# Altium project FMC_PINHEADER_BOARD.PrjPcb
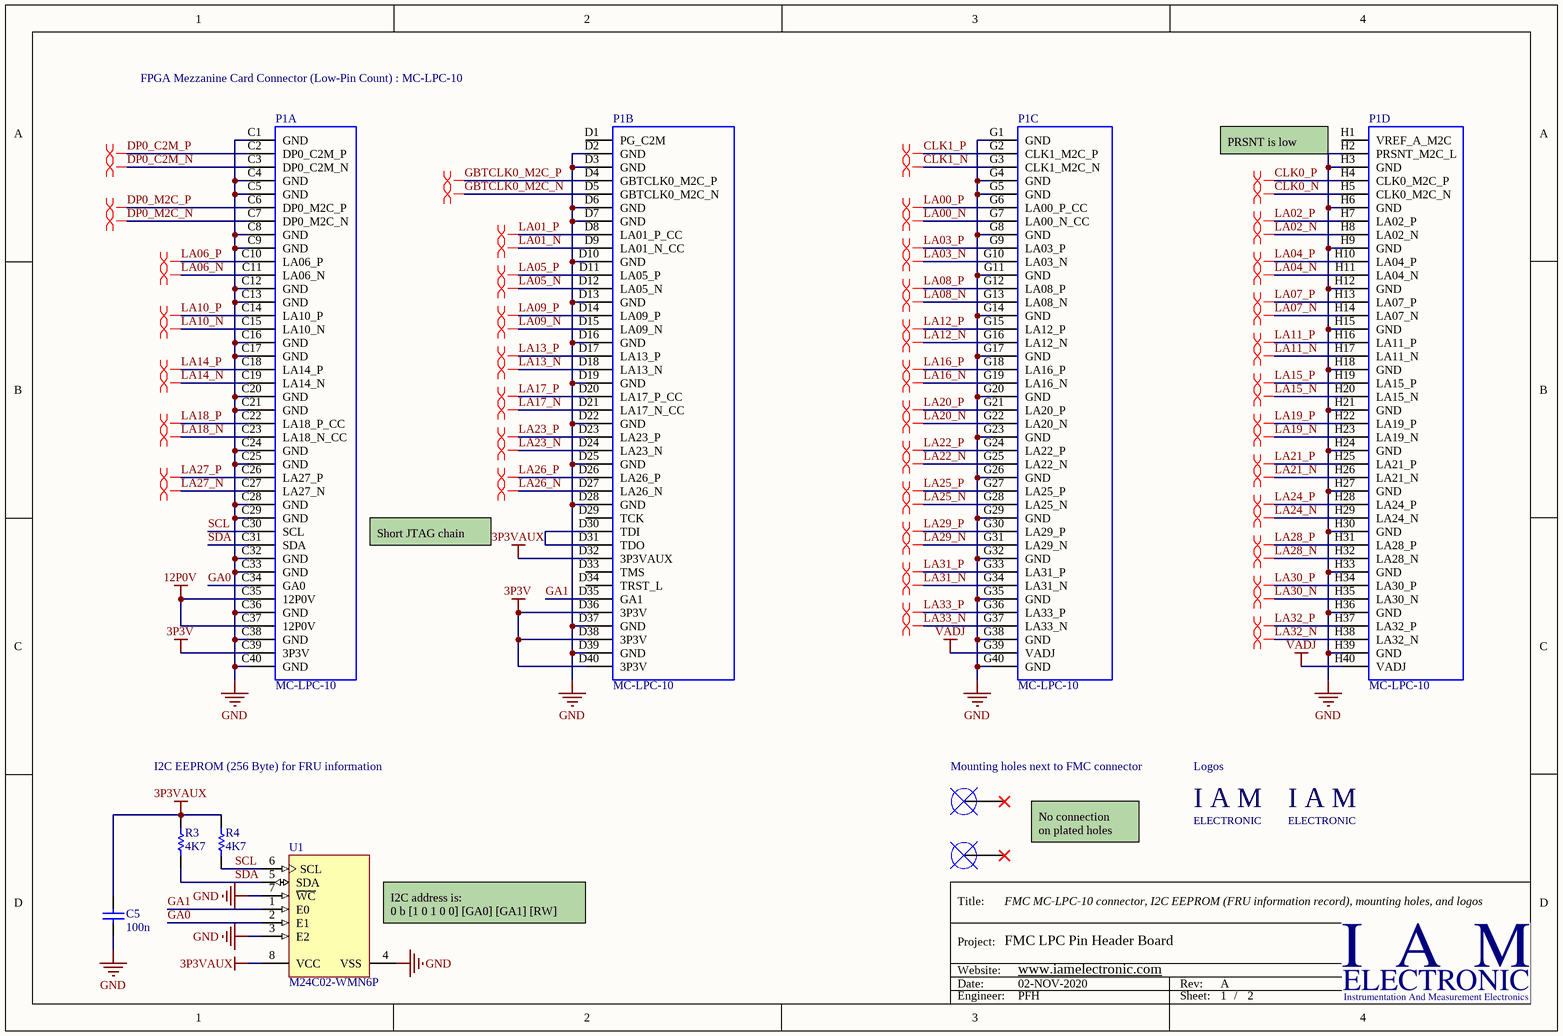
[diagram p0: FMC_LPC.SchDoc]
2 sheets, 25 parts. Net scope: global (net labels, ports and power ports of the same name join across sheets).
Board file: FMC_PINHEADER_BOARD.PcbDoc
Sheets:
  FMC_LPC.SchDoc
  FMC_PINBREAKOUT.SchDoc

## Sheet FMC_LPC.SchDoc: FMC MC-LPC-10 connector, I2C EEPROM (FRU information record), mounting holes, and logos
size A4; Date: 02-NOV-2020; DrawnBy: PFH; Engineer: PFH; Organization: IAM Electronic GmbH; Revision: A; SheetNumber: 1; SheetTotal: 2; Projekt: FMC LPC Pin Header Board; Website: www.iamelectronic.com; ImagePath: FMC LPC Pinheader Board

### Parts
C5  100n  [CAPC1005X55X25ML05T10]
MHN  2.7mm  [Mounting_Hole_Plated_2.7mm-COVERED]  (value not drawn)  (no BOM)
MHS  2.7mm  [Mounting_Hole_Plated_2.7mm-COVERED]  (value not drawn)  (no BOM)
P1  MC-LPC-10  [ASP-134604-01]  (parts A,B,C,D of 4)
R3  4K7  [RESC1005X40X25ML05T05]
R4  4K7  [RESC1005X40X25ML05T05]
STR1  IAM LOGO  [IAM LOGO - SMALL - WWW]  (value not drawn)  (no BOM)
STR2  IAM LOGO  [IAM LOGO - MEDIUM - WWW]  (value not drawn)  (no BOM)
U1  M24C02-WMN6P  [STM-SO-8_D_L]

### Nets
3P3V: P1.C39(3P3V) P1.D36(3P3V) P1.D38(3P3V) P1.D40(3P3V)
3P3VAUX: C5.2 P1.D32(3P3VAUX) R3.2 R4.2 U1.8(VCC)
12P0V: P1.C35(12P0V) P1.C37(12P0V)
GND: C5.1 P1.C1(GND) P1.C4(GND) P1.C5(GND) P1.C8(GND) P1.C9(GND) P1.C12(GND) P1.C13(GND) P1.C16(GND) P1.C17(GND) P1.C20(GND) P1.C21(GND) P1.C24(GND) P1.C25(GND) P1.C28(GND) P1.C29(GND) P1.C32(GND) P1.C33(GND) P1.C36(GND) P1.C38(GND) P1.C40(GND) P1.D2(GND) P1.D3(GND) P1.D6(GND) P1.D7(GND) P1.D10(GND) P1.D13(GND) P1.D16(GND) P1.D19(GND) P1.D22(GND) P1.D25(GND) P1.D28(GND) P1.D37(GND) P1.D39(GND) P1.G1(GND) P1.G4(GND) P1.G5(GND) P1.G8(GND) P1.G11(GND) P1.G14(GND) P1.G17(GND) P1.G20(GND) P1.G23(GND) P1.G26(GND) P1.G29(GND) P1.G32(GND) P1.G35(GND) P1.G38(GND) P1.G40(GND) P1.H2(PRSNT_M2C_L) P1.H3(GND) P1.H6(GND) P1.H9(GND) P1.H12(GND) P1.H15(GND) P1.H18(GND) P1.H21(GND) P1.H24(GND) P1.H27(GND) P1.H30(GND) P1.H33(GND) P1.H36(GND) P1.H39(GND) U1.3(E2) U1.4(VSS) U1.7(~{WC})
VADJ: P1.G39(VADJ) P1.H40(VADJ)
CLK0_N: P1.H5(CLK0_M2C_N)
CLK0_P: P1.H4(CLK0_M2C_P)
CLK1_N: P1.G3(CLK1_M2C_N)
CLK1_P: P1.G2(CLK1_M2C_P)
DP0_C2M_N: P1.C3(DP0_C2M_N)
DP0_C2M_P: P1.C2(DP0_C2M_P)
DP0_M2C_N: P1.C7(DP0_M2C_N)
DP0_M2C_P: P1.C6(DP0_M2C_P)
GA0: P1.C34(GA0) U1.2(E1)
GA1: P1.D35(GA1) U1.1(E0)
GBTCLK0_M2C_N: P1.D5(GBTCLK0_M2C_N)
GBTCLK0_M2C_P: P1.D4(GBTCLK0_M2C_P)
LA00_N: P1.G7(LA00_N_CC)
LA00_P: P1.G6(LA00_P_CC)
LA01_N: P1.D9(LA01_N_CC)
LA01_P: P1.D8(LA01_P_CC)
LA02_N: P1.H8(LA02_N)
LA02_P: P1.H7(LA02_P)
LA03_N: P1.G10(LA03_N)
LA03_P: P1.G9(LA03_P)
LA04_N: P1.H11(LA04_N)
LA04_P: P1.H10(LA04_P)
LA05_N: P1.D12(LA05_N)
LA05_P: P1.D11(LA05_P)
LA06_N: P1.C11(LA06_N)
LA06_P: P1.C10(LA06_P)
LA07_N: P1.H14(LA07_N)
LA07_P: P1.H13(LA07_P)
LA08_N: P1.G13(LA08_N)
LA08_P: P1.G12(LA08_P)
LA09_N: P1.D15(LA09_N)
LA09_P: P1.D14(LA09_P)
LA10_N: P1.C15(LA10_N)
LA10_P: P1.C14(LA10_P)
LA11_N: P1.H17(LA11_N)
LA11_P: P1.H16(LA11_P)
LA12_N: P1.G16(LA12_N)
LA12_P: P1.G15(LA12_P)
LA13_N: P1.D18(LA13_N)
LA13_P: P1.D17(LA13_P)
LA14_N: P1.C19(LA14_N)
LA14_P: P1.C18(LA14_P)
LA15_N: P1.H20(LA15_N)
LA15_P: P1.H19(LA15_P)
LA16_N: P1.G19(LA16_N)
LA16_P: P1.G18(LA16_P)
LA17_N: P1.D21(LA17_N_CC)
LA17_P: P1.D20(LA17_P_CC)
LA18_N: P1.C23(LA18_N_CC)
LA18_P: P1.C22(LA18_P_CC)
LA19_N: P1.H23(LA19_N)
LA19_P: P1.H22(LA19_P)
LA20_N: P1.G22(LA20_N)
LA20_P: P1.G21(LA20_P)
LA21_N: P1.H26(LA21_N)
LA21_P: P1.H25(LA21_P)
LA22_N: P1.G25(LA22_N)
LA22_P: P1.G24(LA22_P)
LA23_N: P1.D24(LA23_N)
LA23_P: P1.D23(LA23_P)
LA24_N: P1.H29(LA24_N)
LA24_P: P1.H28(LA24_P)
LA25_N: P1.G28(LA25_N)
LA25_P: P1.G27(LA25_P)
LA26_N: P1.D27(LA26_N)
LA26_P: P1.D26(LA26_P)
LA27_N: P1.C27(LA27_N)
LA27_P: P1.C26(LA27_P)
LA28_N: P1.H32(LA28_N)
LA28_P: P1.H31(LA28_P)
LA29_N: P1.G31(LA29_N)
LA29_P: P1.G30(LA29_P)
LA30_N: P1.H35(LA30_N)
LA30_P: P1.H34(LA30_P)
LA31_N: P1.G34(LA31_N)
LA31_P: P1.G33(LA31_P)
LA32_N: P1.H38(LA32_N)
LA32_P: P1.H37(LA32_P)
LA33_N: P1.G37(LA33_N)
LA33_P: P1.G36(LA33_P)
SCL: P1.C30(SCL) R4.1 U1.6(SCL)
SDA: P1.C31(SDA) R3.1 U1.5(SDA)
NetP1_D30: P1.D30(TDI) P1.D31(TDO)

Not connected (* = marked no-connect by the designer): MHN 0*; MHS 0*; P1 D1(PG_C2M) D29(TCK) D33(TMS) D34(TRST_L) H1(VREF_A_M2C)

### Layout directives
differential pair: CLK0_N, CLK0_P, CLK1_N, CLK1_P, DP0_C2M_N, DP0_C2M_P, DP0_M2C_N, DP0_M2C_P, GBTCLK0_M2C_N, GBTCLK0_M2C_P, LA00_N, LA00_P, LA01_N, LA01_P, LA02_N, LA02_P, LA03_N, LA03_P, LA04_N, LA04_P, LA05_N, LA05_P, LA06_N, LA06_P, LA07_N, LA07_P, LA08_N, LA08_P, LA09_N, LA09_P, LA10_N, LA10_P, LA11_N, LA11_P, LA12_N, LA12_P, LA13_N, LA13_P, LA14_N, LA14_P, LA15_N, LA15_P, LA16_N, LA16_P, LA17_N, LA17_P, LA18_N, LA18_P, LA19_N, LA19_P, LA20_N, LA20_P, LA21_N, LA21_P, LA22_N, LA22_P, LA23_N, LA23_P, LA24_N, LA24_P, LA25_N, LA25_P, LA26_N, LA26_P, LA27_N, LA27_P, LA28_N, LA28_P, LA29_N, LA29_P, LA30_N, LA30_P, LA31_N, LA31_P, LA32_N, LA32_P, LA33_N, LA33_P

### Notes on the sheet
- FPGA Mezzanine Card Connector (Low-Pin Count) : MC-LPC-10
- (near P1) PRSNT is low
- Short JTAG chain
- I2C EEPROM (256 Byte) for FRU information
- Mounting holes next to FMC connector
- (near STR1) Logos
- No connection
  on plated holes
- (near U1) I2C address is:
  0 b [1 0 1 0 0] [GA0] [GA1] [RW]
- Title:
- Project:
- Date:
- Website:
- Rev:
- Engineer:
- Sheet:
- /
- (in symbol IAM_LOGO) I A M; ELECTRONIC

### Library data of the parts
C5 = CMP-2100-03641-1: Chip Capacitor, 0.1 uF, +/- 10%, 16 V, -55 to 125 degC, 0402 (1005 Metric), RoHS, Tape and Reel; Manufacturer: Murata; Part: GRM155R71C104KA88D; Material: Ceramic; Insulation Resistance: 10GR; Voltage: 16V; Dielectric: X7R; Capacitance: 100nF; REACH SVHC: NoSVHC; Depth: 0.5mm; Case/Package: 0402; Datasheet URL: http://psearch.en.murata.com/capacitor/product/GRM155R71C104KA88%23.pdf; Lead Free: LeadFree; Dielectric Material: Ceramic; Manufacturer URL: http://www.murata.com/; Min Operating Temperature: -55degC; Length: 1mm; Case Code (Metric): 1005; Radiation Hardening: No; Package Reference: 0402; RoHSCompliant: true; Datasheet Version: 42675.0; Thickness: 0.022inch; Packaging: TapeandReel; Voltage Rating (DC): 16V; Tolerance: 10%; Max Operating Temperature: 125degC; Package Description: 2-Pin Surface Mount Device, Body 1 x 0.5 mm; Mount: SurfaceMount; Height: 0.5mm; Width: 0.5mm; Number of Pins: 2; Voltage Rating: 16V; Case Code (Imperial): 0402; Termination: SMD/SMT; Package Quantity: 1
MHN MHS = Mounting_Hole_2.7mm: Mounting hole, hole size 2.7mm; Hole radius: 2.7 mm; Diameter (plated): *; Keep out (radius): *; Plated: *
P1 = MC-LPC-10: MC-LPC-10, FMC Low-pin count connector, lead free, 160 I/Os, male, 10 mm mated stack height; Manufacturer: Samtec; Manufacturer Ref: SEAM-40-03.5-S-10-2-A-K-TR-VITA57; Pitch: 1.27 mm; Mated Stack Height: 10 mm; Solder Type: Lead-Free; Number I/O: 160; PartName: ASP-134604-01; Part: ASP-134604-01; Vita PartNumber: MC-LPC-10; Pin Count: Low; Gender: male; Supplier 1: Digi-Key; Supplier Part Number 1: SAM8732-ND
R3 R4 = CMP-2002-00051-2: Chip Resistor, 4.7 KOhm, +/- 1%, 63 mW, -55 to 155 degC, 0402 (1005 Metric), RoHS, Tape and Reel; PartNumber: CRCW04024K70FKED; Manufacturer: Vishay; Power Rating: 63 mW; Voltage Rating: 50 V; Length: 1 mm; Mount: Surface Mount; Case Code (Metric): 1005; ComponentLink1Description: Datasheet; Package Quantity: 10000; Case Code (Imperial): 0402; Max Operating Temperature: 155 degC; Case/Package: 0402; REACH SVHC: Unknown; PackageDescription: 2-Pin Surface Mount Device, Body 1 x 0.5 mm; Width: 0.5 mm; Min Operating Temperature: -55 degC; Resistance: 4.7 KOhm; Height: 0.35 mm; Packaging: Tape and Reel; Mounting Technology: Surface Mount; Tolerance: 1%; RoHSCompliant: True; ComponentLink1URL: http://www.vishay.com/docs/20035/dcrcwe3.pdf; Part: CRCW04024K70FKED
STR1 STR2 = IAM_LOGO: I A M E L E C T R O N I C - Logo; Layer: Top Overlay; Manufacturer: IAM ELECTRONIC; Part: Logo
U1 = CMP-2000-06638-1: 2-Kbit Serial I2C Bus EEPROM, 2.5 to 5.5 V, -40 to 85 degC, 8-Pin SOIC, RoHS, Tube; Manufacturer: STMicroelectronics; Programming Voltage: 2.5 / V; Interface Type: Serial-I2C; Number of Words: 256; Maximum Random Access Time: 100 / ns; Data Retention: <specialid="6"/>specialid="80"/>200 / yr; Number of Bits per Word: 8 / bit; Memory Size: 2 / kbit; Maximum Operating Supply Voltage: 5.5 / V; Organisation: 256x8; Operating Temperature Range: -40to+85 / °C; Dimensions: 5.000x4.000x1.500 / mm; Height: 1.5 / mm; Operating Supply Voltage Range: 2.5to5.5 / V; Package Type: SO; Manufacturer URL: http://www.st.com/; Package Reference: SO-8; Mounting Technology: SurfaceMount; Package Description: 8-Pin Small Outline Integrated Circuit, Body 4.9 x 3.9 mm, Pitch 1.27 mm; Maximum Operating Temperature: +85 / °C; Datasheet Version: Rev. 2, 09/2013; Minimum Operating Temperature: -40 / °C; Length: 5 / mm; Datasheet URL: http://www.st.com/content/ccc/resource/technical/document/datasheet/b0/d8/50/40/5a/85/49/6f/DM00071904.pdf/files/DM00071904.pdf/jcr:content/translations/en.DM00071904.pdf; Minimum Operating Supply Voltage: 2.5 / V; Mounting Type: SurfaceMount; Pin Count: 8; Width: 4 / mm; Part: M24C02-WMN6P

## Sheet FMC_PINBREAKOUT.SchDoc: 2.54mm Pin Header (3x 42 pos), and SMA jacks (7x)
size A4; Date: 02-NOV-2020; DrawnBy: PFH; Engineer: PFH; Organization: IAM Electronic GmbH; Revision: A; SheetNumber: 2; SheetTotal: 2; Projekt: FMC LPC Pin Header Board; Website: www.iamelectronic.com; ImagePath: FMC LPC Pinheader Board
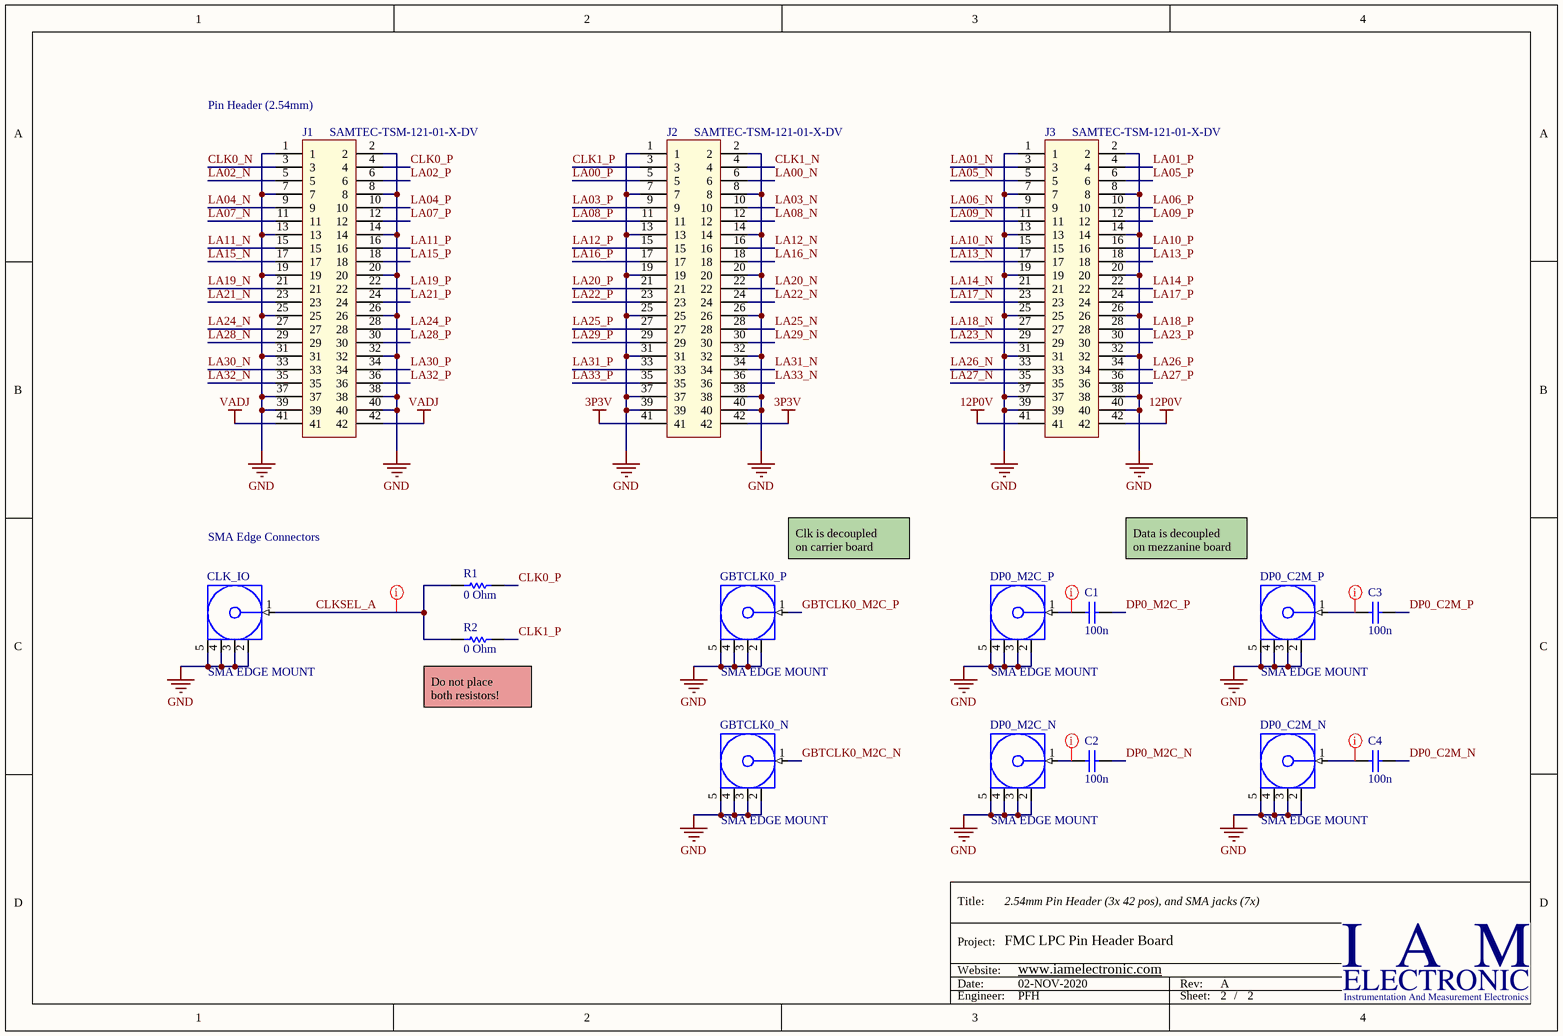
[diagram p1: FMC_PINBREAKOUT.SchDoc]

### Parts
C1  100n  [CAPC1005X55X25ML05T10]
C2  100n  [CAPC1005X55X25ML05T10]
C3  100n  [CAPC1005X55X25ML05T10]
C4  100n  [CAPC1005X55X25ML05T10]
CLK_IO  SMA EDGE MOUNT  [CON-SMA-EDGE062]
DP0_C2M_N  SMA EDGE MOUNT  [CON-SMA-EDGE062]
DP0_C2M_P  SMA EDGE MOUNT  [CON-SMA-EDGE062]
DP0_M2C_N  SMA EDGE MOUNT  [CON-SMA-EDGE062]
DP0_M2C_P  SMA EDGE MOUNT  [CON-SMA-EDGE062]
GBTCLK0_N  SMA EDGE MOUNT  [CON-SMA-EDGE062]
GBTCLK0_P  SMA EDGE MOUNT  [CON-SMA-EDGE062]
J1  SAMTEC-TSM-121-01-X-DV  [SAMTEC-TSM-121-01-X-DV]
J2  SAMTEC-TSM-121-01-X-DV  [SAMTEC-TSM-121-01-X-DV]
J3  SAMTEC-TSM-121-01-X-DV  [SAMTEC-TSM-121-01-X-DV]
R1  0 Ohm  [RESC3116X65X40LL10T20]
R2  0 Ohm  [RESC3116X65X40LL10T20]

### Nets
3P3V: J2.41 J2.42
12P0V: J3.41 J3.42
GND: CLK_IO.2(GND) CLK_IO.3(GND) CLK_IO.4(GND) CLK_IO.5(GND) DP0_C2M_N.2(GND) DP0_C2M_N.3(GND) DP0_C2M_N.4(GND) DP0_C2M_N.5(GND) DP0_C2M_P.2(GND) DP0_C2M_P.3(GND) DP0_C2M_P.4(GND) DP0_C2M_P.5(GND) DP0_M2C_N.2(GND) DP0_M2C_N.3(GND) DP0_M2C_N.4(GND) DP0_M2C_N.5(GND) DP0_M2C_P.2(GND) DP0_M2C_P.3(GND) DP0_M2C_P.4(GND) DP0_M2C_P.5(GND) GBTCLK0_N.2(GND) GBTCLK0_N.3(GND) GBTCLK0_N.4(GND) GBTCLK0_N.5(GND) GBTCLK0_P.2(GND) GBTCLK0_P.3(GND) GBTCLK0_P.4(GND) GBTCLK0_P.5(GND) J1.1 J1.2 J1.7 J1.8 J1.13 J1.14 J1.19 J1.20 J1.25 J1.26 J1.31 J1.32 J1.37 J1.38 J1.39 J1.40 J2.1 J2.2 J2.7 J2.8 J2.13 J2.14 J2.19 J2.20 J2.25 J2.26 J2.31 J2.32 J2.37 J2.38 J2.39 J2.40 J3.1 J3.2 J3.7 J3.8 J3.13 J3.14 J3.19 J3.20 J3.25 J3.26 J3.31 J3.32 J3.37 J3.38 J3.39 J3.40
VADJ: J1.41 J1.42
CLK0_N: J1.3
CLK0_P: J1.4 R1.2
CLK1_N: J2.4
CLK1_P: J2.3 R2.2
CLKSEL_A: CLK_IO.1(Signal) R1.1 R2.1
DP0_C2M_N: C4.2
DP0_C2M_P: C3.2
DP0_M2C_N: C2.2
DP0_M2C_P: C1.2
GBTCLK0_M2C_N: GBTCLK0_N.1(Signal)
GBTCLK0_M2C_P: GBTCLK0_P.1(Signal)
LA00_N: J2.6
LA00_P: J2.5
LA01_N: J3.3
LA01_P: J3.4
LA02_N: J1.5
LA02_P: J1.6
LA03_N: J2.10
LA03_P: J2.9
LA04_N: J1.9
LA04_P: J1.10
LA05_N: J3.5
LA05_P: J3.6
LA06_N: J3.9
LA06_P: J3.10
LA07_N: J1.11
LA07_P: J1.12
LA08_N: J2.12
LA08_P: J2.11
LA09_N: J3.11
LA09_P: J3.12
LA10_N: J3.15
LA10_P: J3.16
LA11_N: J1.15
LA11_P: J1.16
LA12_N: J2.16
LA12_P: J2.15
LA13_N: J3.17
LA13_P: J3.18
LA14_N: J3.21
LA14_P: J3.22
LA15_N: J1.17
LA15_P: J1.18
LA16_N: J2.18
LA16_P: J2.17
LA17_N: J3.23
LA17_P: J3.24
LA18_N: J3.27
LA18_P: J3.28
LA19_N: J1.21
LA19_P: J1.22
LA20_N: J2.22
LA20_P: J2.21
LA21_N: J1.23
LA21_P: J1.24
LA22_N: J2.24
LA22_P: J2.23
LA23_N: J3.29
LA23_P: J3.30
LA24_N: J1.27
LA24_P: J1.28
LA25_N: J2.28
LA25_P: J2.27
LA26_N: J3.33
LA26_P: J3.34
LA27_N: J3.35
LA27_P: J3.36
LA28_N: J1.29
LA28_P: J1.30
LA29_N: J2.30
LA29_P: J2.29
LA30_N: J1.33
LA30_P: J1.34
LA31_N: J2.34
LA31_P: J2.33
LA32_N: J1.35
LA32_P: J1.36
LA33_N: J2.36
LA33_P: J2.35
NetC1_1: C1.1 DP0_M2C_P.1(Signal)
NetC2_1: C2.1 DP0_M2C_N.1(Signal)
NetC3_1: C3.1 DP0_C2M_P.1(Signal)
NetC4_1: C4.1 DP0_C2M_N.1(Signal)

### Layout directives
net class S50: CLKSEL_A, NetC1_1, NetC2_1, NetC3_1, NetC4_1

### Notes on the sheet
- (near J1) Pin Header (2.54mm)
- SMA Edge Connectors
- Clk is decoupled
  on carrier board
- Data is decoupled
  on mezzanine board
- (near R2) Do not place
  both resistors!
- Title:
- Project:
- Date:
- Website:
- Rev:
- Engineer:
- Sheet:
- /

### Library data of the parts
C1-C4 = CMP-2100-03641-1: as C5 on sheet FMC_LPC; REACH SVHC: NoSVHC; Depth: 0.5mm; Case/Package: 0402; Datasheet URL: http://psearch.en.murata.com/capacitor/product/GRM155R71C104KA88%23.pdf; Lead Free: LeadFree; Dielectric Material: Ceramic; Manufacturer URL: http://www.murata.com/; Min Operating Temperature: -55degC; Length: 1mm; Case Code (Metric): 1005; Radiation Hardening: No; Package Reference: 0402; RoHSCompliant: true; Datasheet Version: 42675.0; Thickness: 0.022inch; Packaging: TapeandReel; Voltage Rating (DC): 16V; Tolerance: 10%; Max Operating Temperature: 125degC; Package Description: 2-Pin Surface Mount Device, Body 1 x 0.5 mm; Mount: SurfaceMount; Height: 0.5mm; Width: 0.5mm; Number of Pins: 2; Voltage Rating: 16V; Case Code (Imperial): 0402; Termination: SMD/SMT; Package Quantity: 1
CLK_IO DP0_C2M_N DP0_C2M_P DP0_M2C_N DP0_M2C_P GBTCLK0_N GBTCLK0_P = CMP-0168-00046-1: RP-SMA Female Edge Mount Connector for 0.062" Thick Board; Manufacturer: Samtec; Part: SMA-J-P-H-ST-EM1; PCB_Layout: Pads complies with manufacturer's recommendation.; DatasheetVersion: rev1.0, Jun-2006; PackageVersion: rev1.0, Jun-2006; PackageReference: CON-SMA-EDGE062; PackageDescription: SMA Female Edge Mount for Connector 0.062" Thick Board, Reverse-polarity, 7.9 mm Body Dia.
J1-J3 = SAMTEC-TSM-121-01-X-DV: SMT 2.54mm SQ POST HEADER; Manufacturer: Samtec; Part: TSM-121-01-T-DV; Plating Option: T-Matte Tin; Rows: 2; Pins per row: 21; Post Height: 5.84mm; PARTNO: TSM-121-01-T-DV
R1 R2 = CMP-2100-03681-1: Chip Resistor, 0 Ohm, +/- 5%, -55 to 155 degC, 1206 (3216 Metric), RoHS, Tape and Reel; Manufacturer: Yageo; Part: RC1206JR-070RL; Max Power Dissipation: 250mW; Resistance: 0mOhm; Voltage Rating: 200V; Temperature Coefficient: 200ppm/degreesC; Case Code (Imperial): 1206; Lead Free: LeadFree; Package Quantity: 5000; Radiation Hardening: No; Tolerance: 5%; Length: 3.1mm; Termination: SMD/SMT; Contact Plating: Tin; Military Standard: Not; Manufacturer URL: http://www.yageo.com/; Datasheet URL: http://www.yageo.com/documents/recent/PYu-RC_Group_51_RoHS_L_5.pdf; Height: 0.026inch; RoHSCompliant: true; Min Operating Temperature: -55degC; REACH SVHC: Unknown; Max Operating Temperature: 155degC; Depth: 1.6mm; Packaging: TapeandReel; Package Reference: 1206.0; Number of Terminations: 2; Case/Package: 1206; Composition: CarbonFilm; Case Code (Metric): 3216; Datasheet Version: Rev. 5, 10/2016; Power Rating: 250mW; Package Description: 2-Pin Surface Mount Device, Body 3.1 x 1.6 mm; Width: 0.063inch

## Nets that join several sheets
3P3V: FMC_LPC (P1.C39 P1.D36 P1.D38 P1.D40), FMC_PINBREAKOUT (J2.41 J2.42)
12P0V: FMC_LPC (P1.C35 P1.C37), FMC_PINBREAKOUT (J3.41 J3.42)
GND: FMC_LPC (66 pins), FMC_PINBREAKOUT (76 pins)
VADJ: FMC_LPC (P1.G39 P1.H40), FMC_PINBREAKOUT (J1.41 J1.42)
CLK0_N: FMC_LPC (P1.H5), FMC_PINBREAKOUT (J1.3)
CLK0_P: FMC_LPC (P1.H4), FMC_PINBREAKOUT (J1.4 R1.2)
CLK1_N: FMC_LPC (P1.G3), FMC_PINBREAKOUT (J2.4)
CLK1_P: FMC_LPC (P1.G2), FMC_PINBREAKOUT (J2.3 R2.2)
DP0_C2M_N: FMC_LPC (P1.C3), FMC_PINBREAKOUT (C4.2)
DP0_C2M_P: FMC_LPC (P1.C2), FMC_PINBREAKOUT (C3.2)
DP0_M2C_N: FMC_LPC (P1.C7), FMC_PINBREAKOUT (C2.2)
DP0_M2C_P: FMC_LPC (P1.C6), FMC_PINBREAKOUT (C1.2)
GBTCLK0_M2C_N: FMC_LPC (P1.D5), FMC_PINBREAKOUT (GBTCLK0_N.1)
GBTCLK0_M2C_P: FMC_LPC (P1.D4), FMC_PINBREAKOUT (GBTCLK0_P.1)
LA00_N: FMC_LPC (P1.G7), FMC_PINBREAKOUT (J2.6)
LA00_P: FMC_LPC (P1.G6), FMC_PINBREAKOUT (J2.5)
LA01_N: FMC_LPC (P1.D9), FMC_PINBREAKOUT (J3.3)
LA01_P: FMC_LPC (P1.D8), FMC_PINBREAKOUT (J3.4)
LA02_N: FMC_LPC (P1.H8), FMC_PINBREAKOUT (J1.5)
LA02_P: FMC_LPC (P1.H7), FMC_PINBREAKOUT (J1.6)
LA03_N: FMC_LPC (P1.G10), FMC_PINBREAKOUT (J2.10)
LA03_P: FMC_LPC (P1.G9), FMC_PINBREAKOUT (J2.9)
LA04_N: FMC_LPC (P1.H11), FMC_PINBREAKOUT (J1.9)
LA04_P: FMC_LPC (P1.H10), FMC_PINBREAKOUT (J1.10)
LA05_N: FMC_LPC (P1.D12), FMC_PINBREAKOUT (J3.5)
LA05_P: FMC_LPC (P1.D11), FMC_PINBREAKOUT (J3.6)
LA06_N: FMC_LPC (P1.C11), FMC_PINBREAKOUT (J3.9)
LA06_P: FMC_LPC (P1.C10), FMC_PINBREAKOUT (J3.10)
LA07_N: FMC_LPC (P1.H14), FMC_PINBREAKOUT (J1.11)
LA07_P: FMC_LPC (P1.H13), FMC_PINBREAKOUT (J1.12)
LA08_N: FMC_LPC (P1.G13), FMC_PINBREAKOUT (J2.12)
LA08_P: FMC_LPC (P1.G12), FMC_PINBREAKOUT (J2.11)
LA09_N: FMC_LPC (P1.D15), FMC_PINBREAKOUT (J3.11)
LA09_P: FMC_LPC (P1.D14), FMC_PINBREAKOUT (J3.12)
LA10_N: FMC_LPC (P1.C15), FMC_PINBREAKOUT (J3.15)
LA10_P: FMC_LPC (P1.C14), FMC_PINBREAKOUT (J3.16)
LA11_N: FMC_LPC (P1.H17), FMC_PINBREAKOUT (J1.15)
LA11_P: FMC_LPC (P1.H16), FMC_PINBREAKOUT (J1.16)
LA12_N: FMC_LPC (P1.G16), FMC_PINBREAKOUT (J2.16)
LA12_P: FMC_LPC (P1.G15), FMC_PINBREAKOUT (J2.15)
LA13_N: FMC_LPC (P1.D18), FMC_PINBREAKOUT (J3.17)
LA13_P: FMC_LPC (P1.D17), FMC_PINBREAKOUT (J3.18)
LA14_N: FMC_LPC (P1.C19), FMC_PINBREAKOUT (J3.21)
LA14_P: FMC_LPC (P1.C18), FMC_PINBREAKOUT (J3.22)
LA15_N: FMC_LPC (P1.H20), FMC_PINBREAKOUT (J1.17)
LA15_P: FMC_LPC (P1.H19), FMC_PINBREAKOUT (J1.18)
LA16_N: FMC_LPC (P1.G19), FMC_PINBREAKOUT (J2.18)
LA16_P: FMC_LPC (P1.G18), FMC_PINBREAKOUT (J2.17)
LA17_N: FMC_LPC (P1.D21), FMC_PINBREAKOUT (J3.23)
LA17_P: FMC_LPC (P1.D20), FMC_PINBREAKOUT (J3.24)
LA18_N: FMC_LPC (P1.C23), FMC_PINBREAKOUT (J3.27)
LA18_P: FMC_LPC (P1.C22), FMC_PINBREAKOUT (J3.28)
LA19_N: FMC_LPC (P1.H23), FMC_PINBREAKOUT (J1.21)
LA19_P: FMC_LPC (P1.H22), FMC_PINBREAKOUT (J1.22)
LA20_N: FMC_LPC (P1.G22), FMC_PINBREAKOUT (J2.22)
LA20_P: FMC_LPC (P1.G21), FMC_PINBREAKOUT (J2.21)
LA21_N: FMC_LPC (P1.H26), FMC_PINBREAKOUT (J1.23)
LA21_P: FMC_LPC (P1.H25), FMC_PINBREAKOUT (J1.24)
LA22_N: FMC_LPC (P1.G25), FMC_PINBREAKOUT (J2.24)
LA22_P: FMC_LPC (P1.G24), FMC_PINBREAKOUT (J2.23)
LA23_N: FMC_LPC (P1.D24), FMC_PINBREAKOUT (J3.29)
LA23_P: FMC_LPC (P1.D23), FMC_PINBREAKOUT (J3.30)
LA24_N: FMC_LPC (P1.H29), FMC_PINBREAKOUT (J1.27)
LA24_P: FMC_LPC (P1.H28), FMC_PINBREAKOUT (J1.28)
LA25_N: FMC_LPC (P1.G28), FMC_PINBREAKOUT (J2.28)
LA25_P: FMC_LPC (P1.G27), FMC_PINBREAKOUT (J2.27)
LA26_N: FMC_LPC (P1.D27), FMC_PINBREAKOUT (J3.33)
LA26_P: FMC_LPC (P1.D26), FMC_PINBREAKOUT (J3.34)
LA27_N: FMC_LPC (P1.C27), FMC_PINBREAKOUT (J3.35)
LA27_P: FMC_LPC (P1.C26), FMC_PINBREAKOUT (J3.36)
LA28_N: FMC_LPC (P1.H32), FMC_PINBREAKOUT (J1.29)
LA28_P: FMC_LPC (P1.H31), FMC_PINBREAKOUT (J1.30)
LA29_N: FMC_LPC (P1.G31), FMC_PINBREAKOUT (J2.30)
LA29_P: FMC_LPC (P1.G30), FMC_PINBREAKOUT (J2.29)
LA30_N: FMC_LPC (P1.H35), FMC_PINBREAKOUT (J1.33)
LA30_P: FMC_LPC (P1.H34), FMC_PINBREAKOUT (J1.34)
LA31_N: FMC_LPC (P1.G34), FMC_PINBREAKOUT (J2.34)
LA31_P: FMC_LPC (P1.G33), FMC_PINBREAKOUT (J2.33)
LA32_N: FMC_LPC (P1.H38), FMC_PINBREAKOUT (J1.35)
LA32_P: FMC_LPC (P1.H37), FMC_PINBREAKOUT (J1.36)
LA33_N: FMC_LPC (P1.G37), FMC_PINBREAKOUT (J2.36)
LA33_P: FMC_LPC (P1.G36), FMC_PINBREAKOUT (J2.35)

## Assembly variants
DEFAULT_CLK0_P: not fitted R2